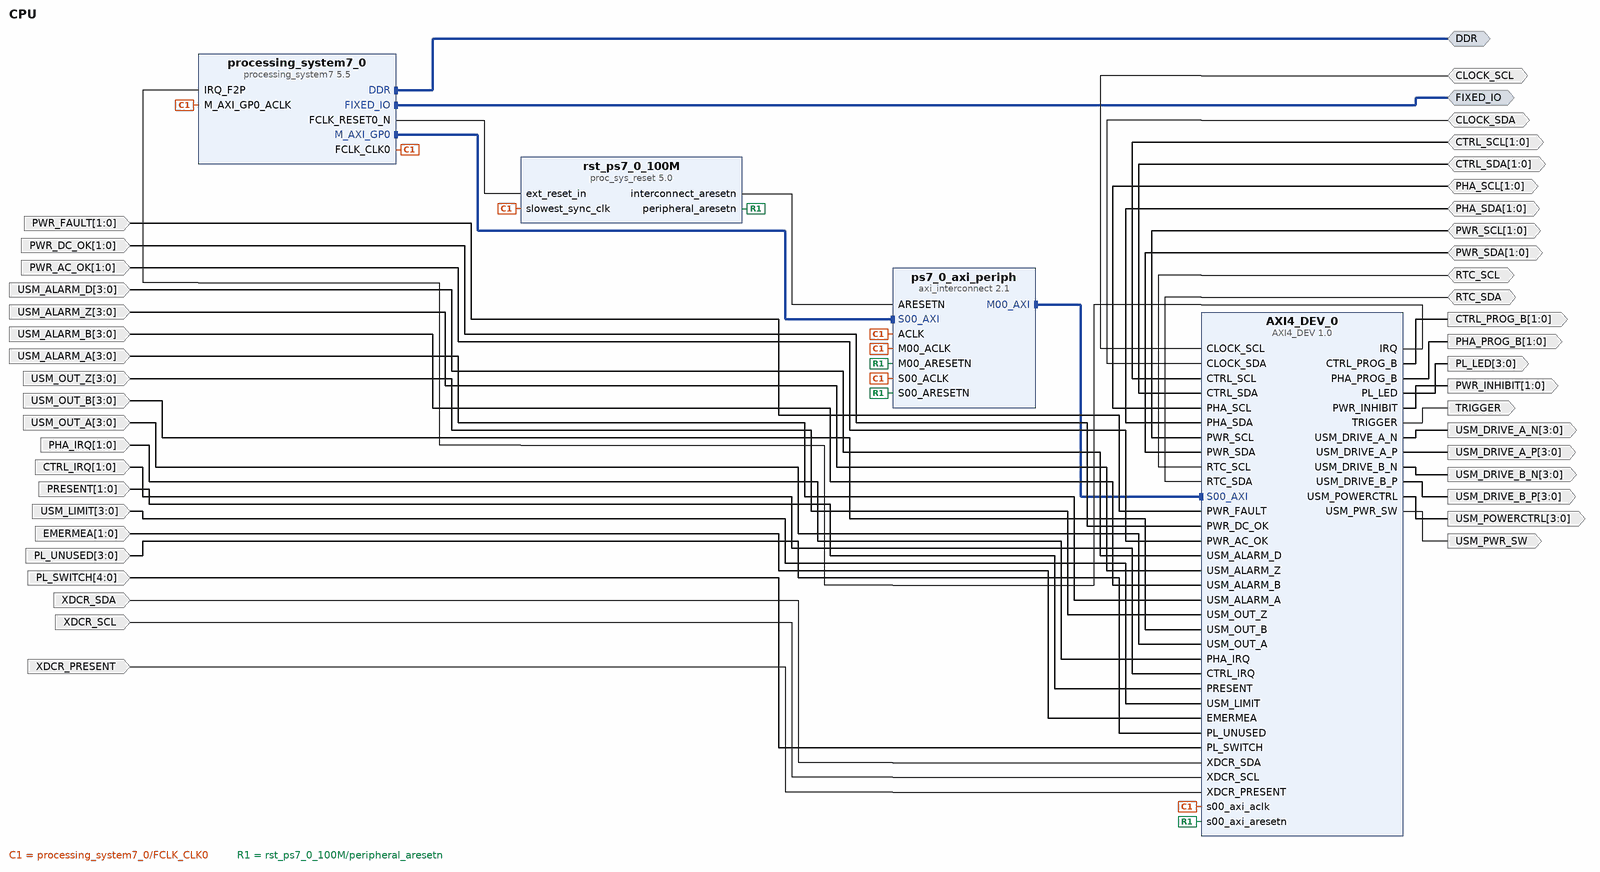
[diagram p0: block diagram of the top level]
# Vivado block design CPU, xc7z020clg484-1, Vivado 2018.2
create_bd_design CPU

create_bd_intf_port -mode Master -vlnv xilinx.com:interface:ddrx_rtl:1.0 DDR
create_bd_intf_port -mode Master -vlnv xilinx.com:display_processing_system7:fixedio_rtl:1.0 FIXED_IO
create_bd_port -dir IO -type clk CLOCK_SCL
create_bd_port -dir IO -type clk CLOCK_SDA
create_bd_port -dir IO -from 1 -to 0 PHA_SCL
create_bd_port -dir IO -from 1 -to 0 PHA_SDA
create_bd_port -dir IO -from 1 -to 0 CTRL_SCL
create_bd_port -dir IO -from 1 -to 0 CTRL_SDA
create_bd_port -dir IO -from 1 -to 0 PWR_SDA
create_bd_port -dir IO -from 1 -to 0 PWR_SCL
create_bd_port -dir O TRIGGER
create_bd_port -dir O USM_PWR_SW
create_bd_port -dir O -from 3 -to 0 PL_LED
create_bd_port -dir IO RTC_SCL
create_bd_port -dir IO RTC_SDA
create_bd_port -dir O -from 1 -to 0 CTRL_PROG_B
create_bd_port -dir O -from 1 -to 0 PHA_PROG_B
create_bd_port -dir O -from 3 -to 0 USM_POWERCTRL
create_bd_port -dir O -from 3 -to 0 USM_DRIVE_A_N
create_bd_port -dir O -from 3 -to 0 USM_DRIVE_A_P
create_bd_port -dir O -from 3 -to 0 USM_DRIVE_B_N
create_bd_port -dir O -from 3 -to 0 USM_DRIVE_B_P
create_bd_port -dir O -from 1 -to 0 PWR_INHIBIT
create_bd_port -dir I -from 1 -to 0 PWR_FAULT
create_bd_port -dir I -from 1 -to 0 PWR_DC_OK
create_bd_port -dir I -from 1 -to 0 PWR_AC_OK
create_bd_port -dir I -from 3 -to 0 USM_ALARM_D
create_bd_port -dir I -from 3 -to 0 USM_ALARM_Z
create_bd_port -dir I -from 3 -to 0 USM_ALARM_B
create_bd_port -dir I -from 3 -to 0 USM_ALARM_A
create_bd_port -dir I -from 3 -to 0 USM_OUT_Z
create_bd_port -dir I -from 3 -to 0 USM_OUT_B
create_bd_port -dir I -from 3 -to 0 USM_OUT_A
create_bd_port -dir I -from 1 -to 0 -type intr PHA_IRQ
set_property -dict {CONFIG.PortWidth 2} [get_bd_ports PHA_IRQ]
create_bd_port -dir I -from 1 -to 0 -type intr CTRL_IRQ
set_property -dict {CONFIG.PortWidth 2} [get_bd_ports CTRL_IRQ]
create_bd_port -dir I -from 1 -to 0 PRESENT
create_bd_port -dir I -from 3 -to 0 USM_LIMIT
create_bd_port -dir I -from 1 -to 0 EMERMEA
create_bd_port -dir I -from 3 -to 0 PL_UNUSED
create_bd_port -dir I -from 4 -to 0 PL_SWITCH
create_bd_port -dir I XDCR_SDA
create_bd_port -dir I XDCR_SCL
create_bd_port -dir I XDCR_PRESENT

create_bd_cell -type ip -vlnv xilinx.com:ip:processing_system7:5.5 processing_system7_0
set_property -dict [list \
  CONFIG.PCW_UIPARAM_DDR_FREQ_MHZ 533.333313 \
  CONFIG.PCW_APU_PERIPHERAL_FREQMHZ 666.666667 \
  CONFIG.PCW_SDIO_PERIPHERAL_FREQMHZ 50 \
  CONFIG.PCW_UART_PERIPHERAL_FREQMHZ 50 \
  CONFIG.PCW_FPGA0_PERIPHERAL_FREQMHZ 50 \
  CONFIG.PCW_FPGA1_PERIPHERAL_FREQMHZ 150.000000 \
  CONFIG.PCW_USE_FABRIC_INTERRUPT 1 \
  CONFIG.PCW_IRQ_F2P_INTR 1 \
  CONFIG.PCW_GP0_EN_MODIFIABLE_TXN 0 \
  CONFIG.PCW_GP1_EN_MODIFIABLE_TXN 0 \
  CONFIG.PCW_PERIPHERAL_BOARD_PRESET part0 \
  CONFIG.PCW_PRESET_BANK1_VOLTAGE {LVCMOS 1.8V} \
  CONFIG.PCW_UIPARAM_DDR_PARTNO {MT41J128M16 HA-15E} \
  CONFIG.PCW_QSPI_PERIPHERAL_ENABLE 1 \
  CONFIG.PCW_QSPI_QSPI_IO {MIO 1 .. 6} \
  CONFIG.PCW_QSPI_GRP_SINGLE_SS_ENABLE 1 \
  CONFIG.PCW_QSPI_GRP_SINGLE_SS_IO {MIO 1 .. 6} \
  CONFIG.PCW_SINGLE_QSPI_DATA_MODE x4 \
  CONFIG.PCW_ENET0_PERIPHERAL_ENABLE 1 \
  CONFIG.PCW_ENET0_ENET0_IO {MIO 16 .. 27} \
  CONFIG.PCW_ENET0_GRP_MDIO_ENABLE 1 \
  CONFIG.PCW_ENET0_GRP_MDIO_IO {MIO 52 .. 53} \
  CONFIG.PCW_ENET_RESET_ENABLE 1 \
  CONFIG.PCW_ENET_RESET_SELECT {Share reset pin} \
  CONFIG.PCW_ENET0_RESET_ENABLE 0 \
  CONFIG.PCW_SD0_PERIPHERAL_ENABLE 1 \
  CONFIG.PCW_SD0_SD0_IO {MIO 40 .. 45} \
  CONFIG.PCW_SD0_GRP_CD_ENABLE 1 \
  CONFIG.PCW_SD0_GRP_CD_IO {MIO 47} \
  CONFIG.PCW_SD0_GRP_WP_ENABLE 1 \
  CONFIG.PCW_SD0_GRP_WP_IO {MIO 46} \
  CONFIG.PCW_UART1_PERIPHERAL_ENABLE 1 \
  CONFIG.PCW_UART1_UART1_IO {MIO 48 .. 49} \
  CONFIG.PCW_USB0_PERIPHERAL_ENABLE 0 \
  CONFIG.PCW_USB_RESET_ENABLE 1 \
  CONFIG.PCW_I2C_RESET_ENABLE 1 \
  CONFIG.PCW_GPIO_MIO_GPIO_ENABLE 1 \
  CONFIG.PCW_GPIO_MIO_GPIO_IO MIO \
  CONFIG.preset ZedBoard \
] [get_bd_cells processing_system7_0]
# 509 more settings of processing_system7_0 are not shown: defaults, MIO pin electricals, DDR timing, and values the tool derives
create_bd_cell -type ip -vlnv xilinx.com:ip:proc_sys_reset:5.0 rst_ps7_0_100M
create_bd_cell -type ip -vlnv xilinx.com:ip:axi_interconnect:2.1 ps7_0_axi_periph
set_property -dict {CONFIG.NUM_MI 1 CONFIG.SYNCHRONIZATION_STAGES 2} [get_bd_cells ps7_0_axi_periph]
create_bd_cell -type ip -vlnv xilinx.com:user:AXI4_DEV:1.0 AXI4_DEV_0

# ---- connections ----

connect_bd_intf_net [get_bd_intf_pins processing_system7_0/M_AXI_GP0] [get_bd_intf_pins ps7_0_axi_periph/S00_AXI]
connect_bd_intf_net [get_bd_intf_pins ps7_0_axi_periph/M00_AXI] [get_bd_intf_pins AXI4_DEV_0/S00_AXI]
connect_bd_intf_net [get_bd_intf_ports DDR] [get_bd_intf_pins processing_system7_0/DDR]
connect_bd_intf_net [get_bd_intf_ports FIXED_IO] [get_bd_intf_pins processing_system7_0/FIXED_IO]
connect_bd_net [get_bd_pins processing_system7_0/FCLK_CLK0] \
  [get_bd_pins processing_system7_0/M_AXI_GP0_ACLK] [get_bd_pins rst_ps7_0_100M/slowest_sync_clk] \
  [get_bd_pins ps7_0_axi_periph/ACLK] [get_bd_pins ps7_0_axi_periph/S00_ACLK] [get_bd_pins ps7_0_axi_periph/M00_ACLK] \
  [get_bd_pins AXI4_DEV_0/s00_axi_aclk]
connect_bd_net [get_bd_pins processing_system7_0/FCLK_RESET0_N] [get_bd_pins rst_ps7_0_100M/ext_reset_in]
connect_bd_net [get_bd_pins rst_ps7_0_100M/peripheral_aresetn] \
  [get_bd_pins ps7_0_axi_periph/S00_ARESETN] [get_bd_pins ps7_0_axi_periph/M00_ARESETN] \
  [get_bd_pins AXI4_DEV_0/s00_axi_aresetn]
connect_bd_net [get_bd_pins rst_ps7_0_100M/interconnect_aresetn] [get_bd_pins ps7_0_axi_periph/ARESETN]
connect_bd_net [get_bd_pins AXI4_DEV_0/IRQ] [get_bd_pins processing_system7_0/IRQ_F2P]
connect_bd_net [get_bd_ports CLOCK_SCL] [get_bd_pins AXI4_DEV_0/CLOCK_SCL]
connect_bd_net [get_bd_ports CLOCK_SDA] [get_bd_pins AXI4_DEV_0/CLOCK_SDA]
connect_bd_net [get_bd_ports PHA_SCL] [get_bd_pins AXI4_DEV_0/PHA_SCL]
connect_bd_net [get_bd_ports PHA_SDA] [get_bd_pins AXI4_DEV_0/PHA_SDA]
connect_bd_net [get_bd_ports CTRL_SCL] [get_bd_pins AXI4_DEV_0/CTRL_SCL]
connect_bd_net [get_bd_ports CTRL_SDA] [get_bd_pins AXI4_DEV_0/CTRL_SDA]
connect_bd_net [get_bd_ports PWR_SDA] [get_bd_pins AXI4_DEV_0/PWR_SDA]
connect_bd_net [get_bd_ports PWR_SCL] [get_bd_pins AXI4_DEV_0/PWR_SCL]
connect_bd_net [get_bd_pins AXI4_DEV_0/TRIGGER] [get_bd_ports TRIGGER]
connect_bd_net [get_bd_pins AXI4_DEV_0/USM_PWR_SW] [get_bd_ports USM_PWR_SW]
connect_bd_net [get_bd_pins AXI4_DEV_0/PL_LED] [get_bd_ports PL_LED]
connect_bd_net [get_bd_ports RTC_SCL] [get_bd_pins AXI4_DEV_0/RTC_SCL]
connect_bd_net [get_bd_ports RTC_SDA] [get_bd_pins AXI4_DEV_0/RTC_SDA]
connect_bd_net [get_bd_pins AXI4_DEV_0/CTRL_PROG_B] [get_bd_ports CTRL_PROG_B]
connect_bd_net [get_bd_pins AXI4_DEV_0/PHA_PROG_B] [get_bd_ports PHA_PROG_B]
connect_bd_net [get_bd_pins AXI4_DEV_0/USM_POWERCTRL] [get_bd_ports USM_POWERCTRL]
connect_bd_net [get_bd_pins AXI4_DEV_0/USM_DRIVE_A_N] [get_bd_ports USM_DRIVE_A_N]
connect_bd_net [get_bd_pins AXI4_DEV_0/USM_DRIVE_A_P] [get_bd_ports USM_DRIVE_A_P]
connect_bd_net [get_bd_pins AXI4_DEV_0/USM_DRIVE_B_N] [get_bd_ports USM_DRIVE_B_N]
connect_bd_net [get_bd_pins AXI4_DEV_0/USM_DRIVE_B_P] [get_bd_ports USM_DRIVE_B_P]
connect_bd_net [get_bd_pins AXI4_DEV_0/PWR_INHIBIT] [get_bd_ports PWR_INHIBIT]
connect_bd_net [get_bd_ports PWR_FAULT] [get_bd_pins AXI4_DEV_0/PWR_FAULT]
connect_bd_net [get_bd_ports PWR_DC_OK] [get_bd_pins AXI4_DEV_0/PWR_DC_OK]
connect_bd_net [get_bd_ports PWR_AC_OK] [get_bd_pins AXI4_DEV_0/PWR_AC_OK]
connect_bd_net [get_bd_ports USM_ALARM_D] [get_bd_pins AXI4_DEV_0/USM_ALARM_D]
connect_bd_net [get_bd_ports USM_ALARM_Z] [get_bd_pins AXI4_DEV_0/USM_ALARM_Z]
connect_bd_net [get_bd_ports USM_ALARM_B] [get_bd_pins AXI4_DEV_0/USM_ALARM_B]
connect_bd_net [get_bd_ports USM_ALARM_A] [get_bd_pins AXI4_DEV_0/USM_ALARM_A]
connect_bd_net [get_bd_ports USM_OUT_Z] [get_bd_pins AXI4_DEV_0/USM_OUT_Z]
connect_bd_net [get_bd_ports USM_OUT_B] [get_bd_pins AXI4_DEV_0/USM_OUT_B]
connect_bd_net [get_bd_ports USM_OUT_A] [get_bd_pins AXI4_DEV_0/USM_OUT_A]
connect_bd_net [get_bd_ports PHA_IRQ] [get_bd_pins AXI4_DEV_0/PHA_IRQ]
connect_bd_net [get_bd_ports CTRL_IRQ] [get_bd_pins AXI4_DEV_0/CTRL_IRQ]
connect_bd_net [get_bd_ports PRESENT] [get_bd_pins AXI4_DEV_0/PRESENT]
connect_bd_net [get_bd_ports USM_LIMIT] [get_bd_pins AXI4_DEV_0/USM_LIMIT]
connect_bd_net [get_bd_ports EMERMEA] [get_bd_pins AXI4_DEV_0/EMERMEA]
connect_bd_net [get_bd_ports PL_UNUSED] [get_bd_pins AXI4_DEV_0/PL_UNUSED]
connect_bd_net [get_bd_ports PL_SWITCH] [get_bd_pins AXI4_DEV_0/PL_SWITCH]
connect_bd_net -net XDCR_SDA_0_1 [get_bd_ports XDCR_SDA] [get_bd_pins AXI4_DEV_0/XDCR_SDA]
connect_bd_net -net XDCR_SCL_0_1 [get_bd_ports XDCR_SCL] [get_bd_pins AXI4_DEV_0/XDCR_SCL]
connect_bd_net -net XDCR_PRESENT_0_1 [get_bd_ports XDCR_PRESENT] [get_bd_pins AXI4_DEV_0/XDCR_PRESENT]

# ---- address map ----
assign_bd_address -offset 0x43C00000 -range 64K -target_address_space [get_bd_addr_spaces processing_system7_0/Data] [get_bd_addr_segs AXI4_DEV_0/S00_AXI/S00_AXI_reg]

validate_bd_design
save_bd_design
